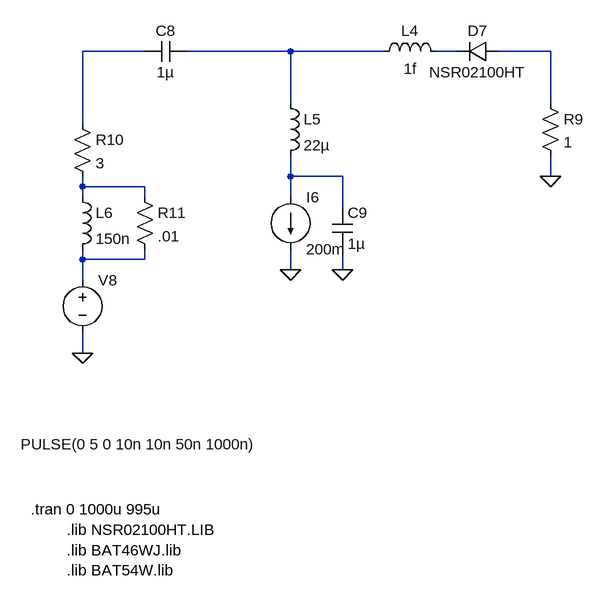
[diagram p0: schematic recovery_test.asc]
recovery_test.asc, the LTspice schematic file:
Version 4
SHEET 1 880 1848
WIRE -576 1040 -672 1040
WIRE -352 1040 -512 1040
WIRE -208 1040 -352 1040
WIRE -96 1040 -128 1040
WIRE 48 1040 -32 1040
WIRE -352 1120 -352 1040
WIRE 48 1120 48 1040
WIRE -672 1152 -672 1040
WIRE -352 1232 -352 1200
WIRE -272 1232 -352 1232
WIRE 48 1232 48 1200
WIRE -672 1248 -672 1232
WIRE -576 1248 -672 1248
WIRE -672 1264 -672 1248
WIRE -576 1264 -576 1248
WIRE -352 1264 -352 1232
WIRE -272 1280 -272 1232
WIRE -672 1360 -672 1344
WIRE -576 1360 -576 1344
WIRE -576 1360 -672 1360
WIRE -352 1376 -352 1344
WIRE -272 1376 -272 1344
WIRE -672 1392 -672 1360
WIRE -672 1504 -672 1472
FLAG 48 1232 0
FLAG -352 1376 0
FLAG -672 1504 0
FLAG -272 1376 0
SYMBOL voltage -672 1376 R0
WINDOW 123 0 0 Left 0
WINDOW 39 0 0 Left 0
WINDOW 3 -95 268 Left 2
SYMATTR Value PULSE(0 5 0 10n 10n 50n 1000n)
SYMATTR InstName V8
SYMBOL cap -512 1024 R90
WINDOW 0 0 32 VBottom 2
WINDOW 3 32 32 VTop 2
SYMATTR InstName C8
SYMATTR Value 1µ
SYMBOL diode -32 1024 R90
WINDOW 0 0 32 VBottom 2
WINDOW 3 32 32 VTop 2
SYMATTR InstName D7
SYMATTR Value NSR02100HT
SYMBOL current -352 1264 R0
WINDOW 123 0 0 Left 0
WINDOW 39 0 0 Left 0
SYMATTR InstName I6
SYMATTR Value 200m
SYMBOL res 32 1104 R0
SYMATTR InstName R9
SYMATTR Value 1
SYMBOL res -688 1136 R0
SYMATTR InstName R10
SYMATTR Value 3
SYMBOL ind -224 1056 R270
WINDOW 0 32 56 VTop 2
WINDOW 3 5 56 VBottom 2
SYMATTR InstName L4
SYMATTR Value 1f
SYMBOL cap -288 1280 R0
SYMATTR InstName C9
SYMATTR Value 1µ
SYMBOL ind -368 1104 R0
SYMATTR InstName L5
SYMATTR Value 22µ
SYMBOL ind -688 1248 R0
SYMATTR InstName L6
SYMATTR Value 150n
SYMBOL res -592 1248 R0
SYMATTR InstName R11
SYMATTR Value .01
TEXT -696 1776 Left 2 !.lib NSR02100HT.LIB\n.lib BAT46WJ.lib\n.lib BAT54W.lib
TEXT -752 1744 Left 2 !.tran 0 1000u 995u

The netlist it stands for:
* recovery_test.asc
V8 N007 0 PULSE(0 5 0 10n 10n 50n 1000n)
C8 N002 N001 1µ
D7 N004 N003 NSR02100HT
I6 N005 0 200m
R9 N004 0 1
R10 N001 N006 3
L4 N002 N003 1f
C9 N005 0 1µ
L5 N002 N005 22µ
L6 N006 N007 150n
R11 N006 N007 .01
.model D D
.lib standard.dio
.lib NSR02100HT.LIB
.lib BAT46WJ.lib
.lib BAT54W.lib
.tran 0 1000u 995u
.backanno
.end